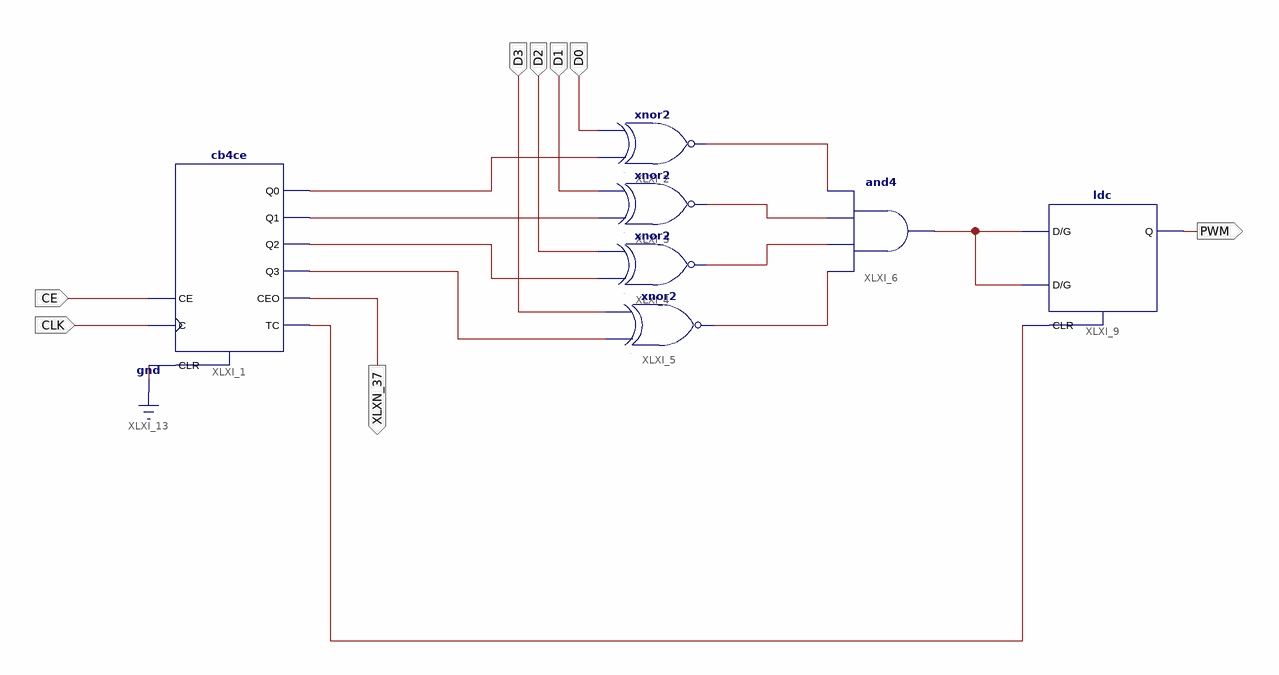
[diagram p0: schematic sheet 1]
// Xilinx ISE schematic PWM.sch (spartan3e) as structural Verilog: 7 symbols, 8 ports
module PWM (
  input  CLK,
  input  D0,
  input  D1,
  input  D2,
  input  D3,
  input  CE,
  output PWM,
  output XLXN_37
);

  wire XLXN_12, XLXN_13, XLXN_14, XLXN_15, XLXN_24, XLXN_25, XLXN_26, XLXN_32, XLXN_39, XLXN_43;

  cb4ce XLXI_1 (
    .C(CLK), .CE(CE), .CLR(1'b0), .CEO(XLXN_37), .Q0(XLXN_24), .Q1(XLXN_25), .Q2(XLXN_26), .Q3(XLXN_39),
    .TC(XLXN_43));
  xnor XLXI_2 (XLXN_12, XLXN_24, D0);
  xnor XLXI_3 (XLXN_13, XLXN_25, D1);
  xnor XLXI_4 (XLXN_14, XLXN_26, D2);
  xnor XLXI_5 (XLXN_15, XLXN_39, D3);
  and XLXI_6 (XLXN_32, XLXN_15, XLXN_14, XLXN_13, XLXN_12);
  ldc XLXI_9 (.CLR(XLXN_43), .D(XLXN_32), .G(XLXN_32), .Q(PWM));
endmodule
